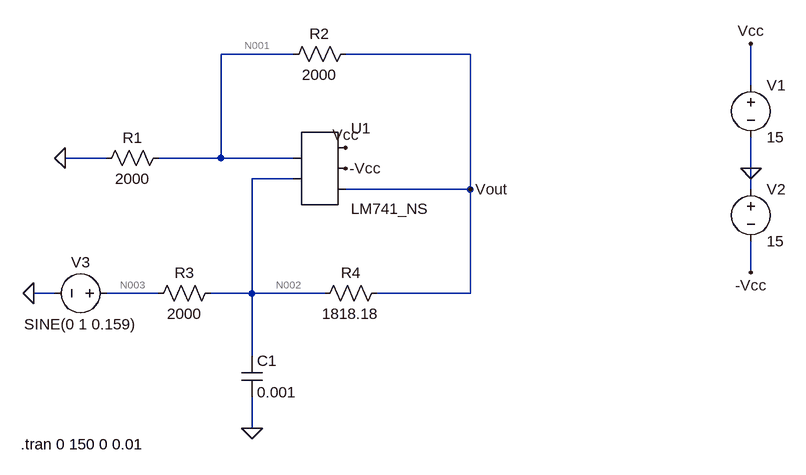
[diagram p0: schematic es17btech11009.asc]
* es17btech11009.asc
* U1: LM741_NS (symbol AutoGenerated\LM741_NS not available, pins judged from their places): pin1=N001 pin2=N002 pin3=Vcc pin4=-Vcc pin5=Vout
R1 N001 0 2000
R2 Vout N001 2000
R3 N002 N003 2000
R4 Vout N002 1818.18
C1 N002 0 0.001
V1 Vcc 0 15
V2 0 -Vcc 15
V3 N003 0 SINE(0 1 0.159)
.tran 0 150 0 0.01
.backanno
.end

* Results of the author's LTspice run, read from the files saved beside the schematic
* Operating Point, zero values left out:
*   V(n002) = 22.77 mV
*   V(n001) = 21.77 mV
*   V(-vcc) = -15 V
*   V(vcc) = 15 V
*   V(vout) = 43.66 mV
*   I(R4) = 11.49 µA
*   I(R3) = 11.39 µA
*   I(R2) = 10.94 µA
*   I(R1) = 10.89 µA
*   I(V3) = 11.39 µA
*   I(V2) = -1.691 mA
*   I(V1) = -1.713 mA
*   Ix(u1:1) = 57.86 nA
*   Ix(u1:2) = 101.9 nA
*   Ix(u1:99) = 1.713 mA
*   Ix(u1:50) = -1.691 mA
*   Ix(u1:28) = -22.43 µA
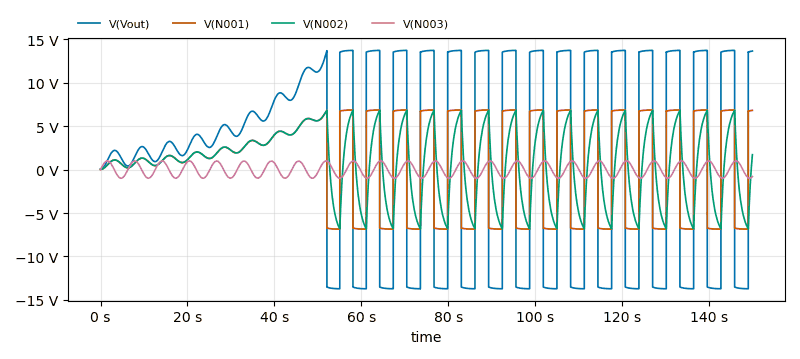
[diagram p1: Transient Analysis of es17btech11009.asc, plotted from the saved traces]
* Transient Analysis, 1 run:
*   V(Vout): min -13.73 V, max 13.73 V, average 1.486 V, rms 11.58 V, last 13.65 V
*   V(N001): min -6.864 V, max 6.864 V, average 743.1 mV, rms 5.786 V, last 6.816 V
*   V(N002): min -6.834 V, max 6.836 V, average 769 mV, rms 4.16 V, last 1.718 V
*   V(N003): min -1 V, max 1 V, average 2.762 mV, rms 706.8 mV, last -809 mV